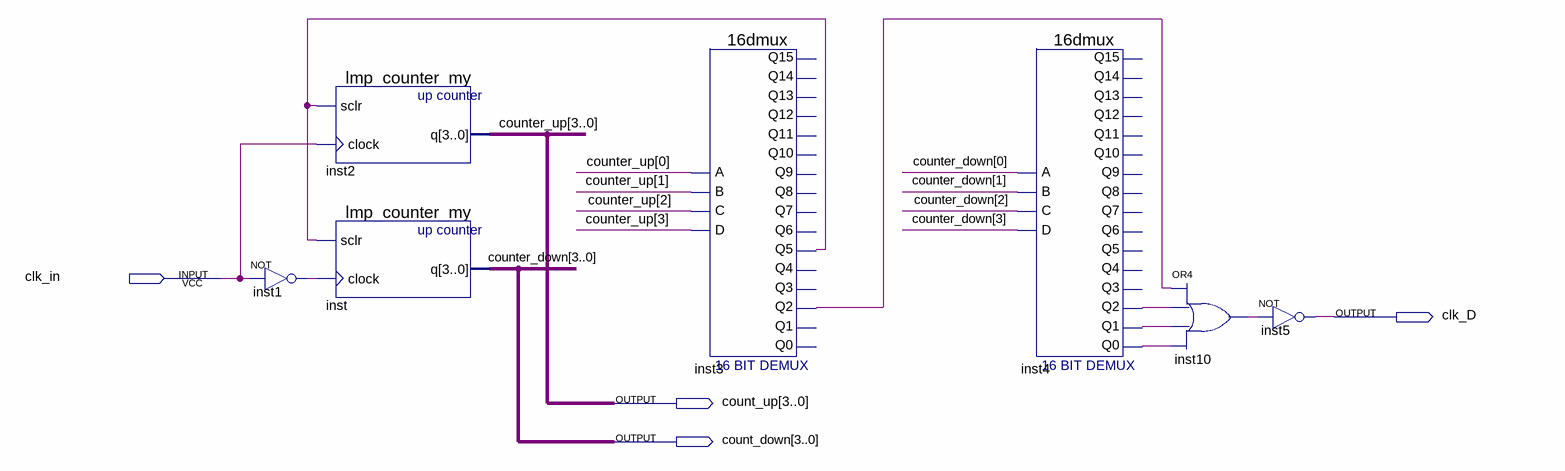
[diagram p0: schematic sheet]
// Quartus schematic Block2.bdf as structural Verilog: 7 symbols, 4 pins
module Block2 (
  input  clk_in,
  output clk_D,
  output [3:0] count_up,
  output [3:0] count_down
);

  wire inst1_out, inst3_q2, inst3_q5, inst4_q0, inst4_q1, inst4_q2, inst10_out;

  lmp_counter_my inst2 (.sclr(inst3_q5), .clock(clk_in), .q(count_up));
  lmp_counter_my inst (.sclr(inst3_q5), .clock(inst1_out), .q(count_down));
  not inst1 (inst1_out, clk_in);
  \16dmux  inst3 (
    .C(count_up[2]), .B(count_up[1]), .A(count_up[0]), .D(count_up[3]), .Q5(inst3_q5), .Q2(inst3_q2));  // open: Q12, Q13, Q11, Q9, Q10, Q7, Q8, Q4, Q6, Q3, Q14, Q15, Q0, Q1
  \16dmux  inst4 (
    .C(count_down[2]), .B(count_down[1]), .A(count_down[0]), .D(count_down[3]), .Q2(inst4_q2), .Q0(inst4_q0),
    .Q1(inst4_q1));  // open: Q12, Q13, Q11, Q9, Q10, Q7, Q8, Q4, Q5, Q6, Q3, Q14, Q15
  or inst10 (inst10_out, inst3_q2, inst4_q2, inst4_q1, inst4_q0);
  not inst5 (clk_D, inst10_out);

  // Other names for the same wires on the sheet: counter_down[3:0] = count_down; counter_up[3:0] = count_up
endmodule
